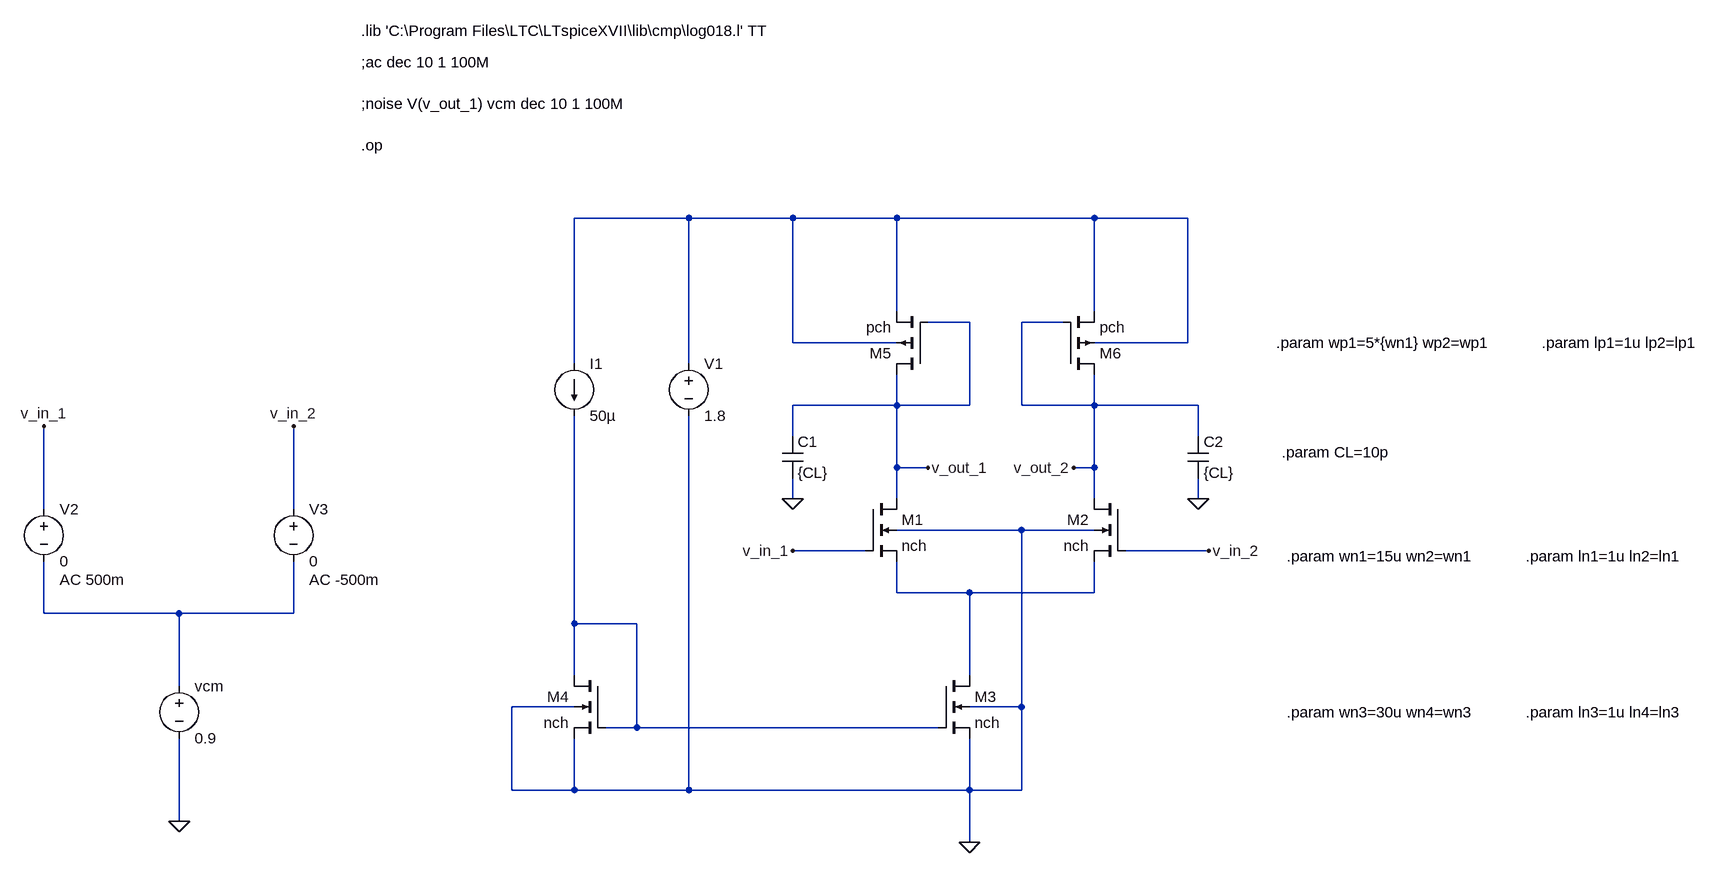
[diagram p0: schematic differential-pair-current-mirror.asc]
differential-pair-current-mirror.asc, the LTspice schematic file:
Version 4
SHEET 1 1760 1108
WIRE 176 128 0 128
WIRE 336 128 176 128
WIRE 496 128 336 128
WIRE 800 128 496 128
WIRE 944 128 800 128
WIRE 496 272 496 128
WIRE 800 272 800 128
WIRE 608 288 544 288
WIRE 752 288 688 288
WIRE 336 320 336 128
WIRE 496 320 336 320
WIRE 944 320 944 128
WIRE 944 320 800 320
WIRE 0 352 0 128
WIRE 176 352 176 128
WIRE 496 416 496 368
WIRE 496 416 336 416
WIRE 608 416 608 288
WIRE 608 416 496 416
WIRE 688 416 688 288
WIRE 800 416 800 368
WIRE 800 416 688 416
WIRE 960 416 800 416
WIRE 336 464 336 416
WIRE 960 464 960 416
WIRE 496 512 496 416
WIRE 544 512 496 512
WIRE 800 512 800 416
WIRE 800 512 768 512
WIRE 336 560 336 528
WIRE 496 560 496 512
WIRE 800 560 800 512
WIRE 960 560 960 528
WIRE -816 576 -816 448
WIRE -432 576 -432 448
WIRE 688 608 496 608
WIRE 800 608 688 608
WIRE 448 640 336 640
WIRE 976 640 848 640
WIRE 496 704 496 656
WIRE 608 704 496 704
WIRE 800 704 800 656
WIRE 800 704 608 704
WIRE -816 736 -816 656
WIRE -608 736 -816 736
WIRE -432 736 -432 656
WIRE -432 736 -608 736
WIRE 0 752 0 432
WIRE 96 752 0 752
WIRE 0 832 0 752
WIRE 608 832 608 704
WIRE -608 848 -608 736
WIRE 0 880 -96 880
WIRE 688 880 688 608
WIRE 688 880 608 880
WIRE 96 912 96 752
WIRE 96 912 48 912
WIRE 560 912 96 912
WIRE -96 1008 -96 880
WIRE 0 1008 0 928
WIRE 0 1008 -96 1008
WIRE 176 1008 176 432
WIRE 176 1008 0 1008
WIRE 608 1008 608 928
WIRE 608 1008 176 1008
WIRE 688 1008 688 880
WIRE 688 1008 608 1008
WIRE -608 1056 -608 928
WIRE 608 1088 608 1008
FLAG 608 1088 0
FLAG -608 1056 0
FLAG 336 640 v_in_1
FLAG 976 640 v_in_2
FLAG -816 448 v_in_1
FLAG -432 448 v_in_2
FLAG 544 512 v_out_1
FLAG 768 512 v_out_2
FLAG 336 560 0
FLAG 960 560 0
SYMBOL nmos4 448 560 R0
SYMATTR InstName M1
SYMATTR Value nch
SYMATTR Value2 l=ln1 w=wn1
SYMBOL nmos4 848 560 M0
SYMATTR InstName M2
SYMATTR Value nch
SYMATTR Value2 l={ln2} w={wn2}
SYMBOL nmos4 560 832 R0
SYMATTR InstName M3
SYMATTR Value nch
SYMATTR Value2 l=ln3 w=wn3
SYMBOL nmos4 48 832 M0
SYMATTR InstName M4
SYMATTR Value nch
SYMATTR Value2 l=ln4 w=wn4
SYMBOL pmos4 544 368 R180
SYMATTR InstName M5
SYMATTR Value pch
SYMATTR Value2 l={lp1} w={wp1}
SYMBOL pmos4 752 368 M180
SYMATTR InstName M6
SYMATTR Value pch
SYMATTR Value2 l={lp2} w={wp2}
SYMBOL current 0 352 R0
SYMATTR InstName I1
SYMATTR Value 50µ
SYMBOL voltage 176 336 R0
WINDOW 123 0 0 Left 0
WINDOW 39 0 0 Left 0
SYMATTR InstName V1
SYMATTR Value 1.8
SYMBOL voltage -816 560 R0
WINDOW 123 24 124 Left 2
WINDOW 39 0 0 Left 0
SYMATTR Value2 AC 500m
SYMATTR InstName V2
SYMATTR Value 0
SYMBOL voltage -608 832 R0
WINDOW 123 0 0 Left 0
WINDOW 39 0 0 Left 0
SYMATTR InstName vcm
SYMATTR Value 0.9
SYMBOL voltage -432 560 R0
WINDOW 123 24 124 Left 2
WINDOW 39 0 0 Left 0
SYMATTR Value2 AC -500m
SYMATTR InstName V3
SYMATTR Value 0
SYMBOL cap 320 464 R0
SYMATTR InstName C1
SYMATTR Value {CL}
SYMBOL cap 944 464 R0
SYMATTR InstName C2
SYMATTR Value {CL}
TEXT -328 -160 Left 2 !.lib 'C:\\Program Files\\LTC\\LTspiceXVII\\lib\\cmp\\log018.l' TT
TEXT -328 -112 Left 2 !;ac dec 10 1 100M
TEXT 1080 320 Left 2 !.param wp1=5*{wn1} wp2=wp1
TEXT 1096 648 Left 2 !.param wn1=15u wn2=wn1
TEXT 1488 320 Left 2 !.param lp1=1u lp2=lp1
TEXT 1464 648 Left 2 !.param ln1=1u ln2=ln1
TEXT 1096 888 Left 2 !.param wn3=30u wn4=wn3
TEXT 1464 888 Left 2 !.param ln3=1u ln4=ln3
TEXT -328 -48 Left 2 !;noise V(v_out_1) vcm dec 10 1 100M
TEXT -328 16 Left 2 !.op
TEXT 1088 488 Left 2 !.param CL=10p

The netlist it stands for:
* differential-pair-current-mirror.asc
M1 v_out_1 v_in_1 N002 0 nch l=ln1 w=wn1
M2 v_out_2 v_in_2 N002 0 nch l={ln2} w={wn2}
M3 N002 N004 0 0 nch l=ln3 w=wn3
M4 N004 N004 0 0 nch l=ln4 w=wn4
M5 v_out_1 v_out_1 N001 N001 pch l={lp1} w={wp1}
M6 v_out_2 v_out_2 N001 N001 pch l={lp2} w={wp2}
I1 N001 N004 50µ
V1 N001 0 1.8
V2 v_in_1 N003 0 AC 500m
vcm N003 0 0.9
V3 v_in_2 N003 0 AC -500m
C1 v_out_1 0 {CL}
C2 v_out_2 0 {CL}
.model NMOS NMOS
.model PMOS PMOS
.lib standard.mos
.lib 'C:\Program Files\LTC\LTspiceXVII\lib\cmp\log018.l' TT
;ac dec 10 1 100M
.param wp1=5*{wn1} wp2=wp1
.param wn1=15u wn2=wn1
.param lp1=1u lp2=lp1
.param ln1=1u ln2=ln1
.param wn3=30u wn4=wn3
.param ln3=1u ln4=ln3
;noise V(v_out_1) vcm dec 10 1 100M
.op
.param CL=10p
.backanno
.end